# Altium schematic sheet NG2094_Connector_B.SchDoc: =project_title
size Tabloid; CompanyName: Luxonis Holding; Organization: Luxonis Holding; Address1: 1925 Harmony Park Drive; Address2: Westminster, CO; Address3: 80234; Address4: United States; SheetNumber: 4; SheetTotal: 11
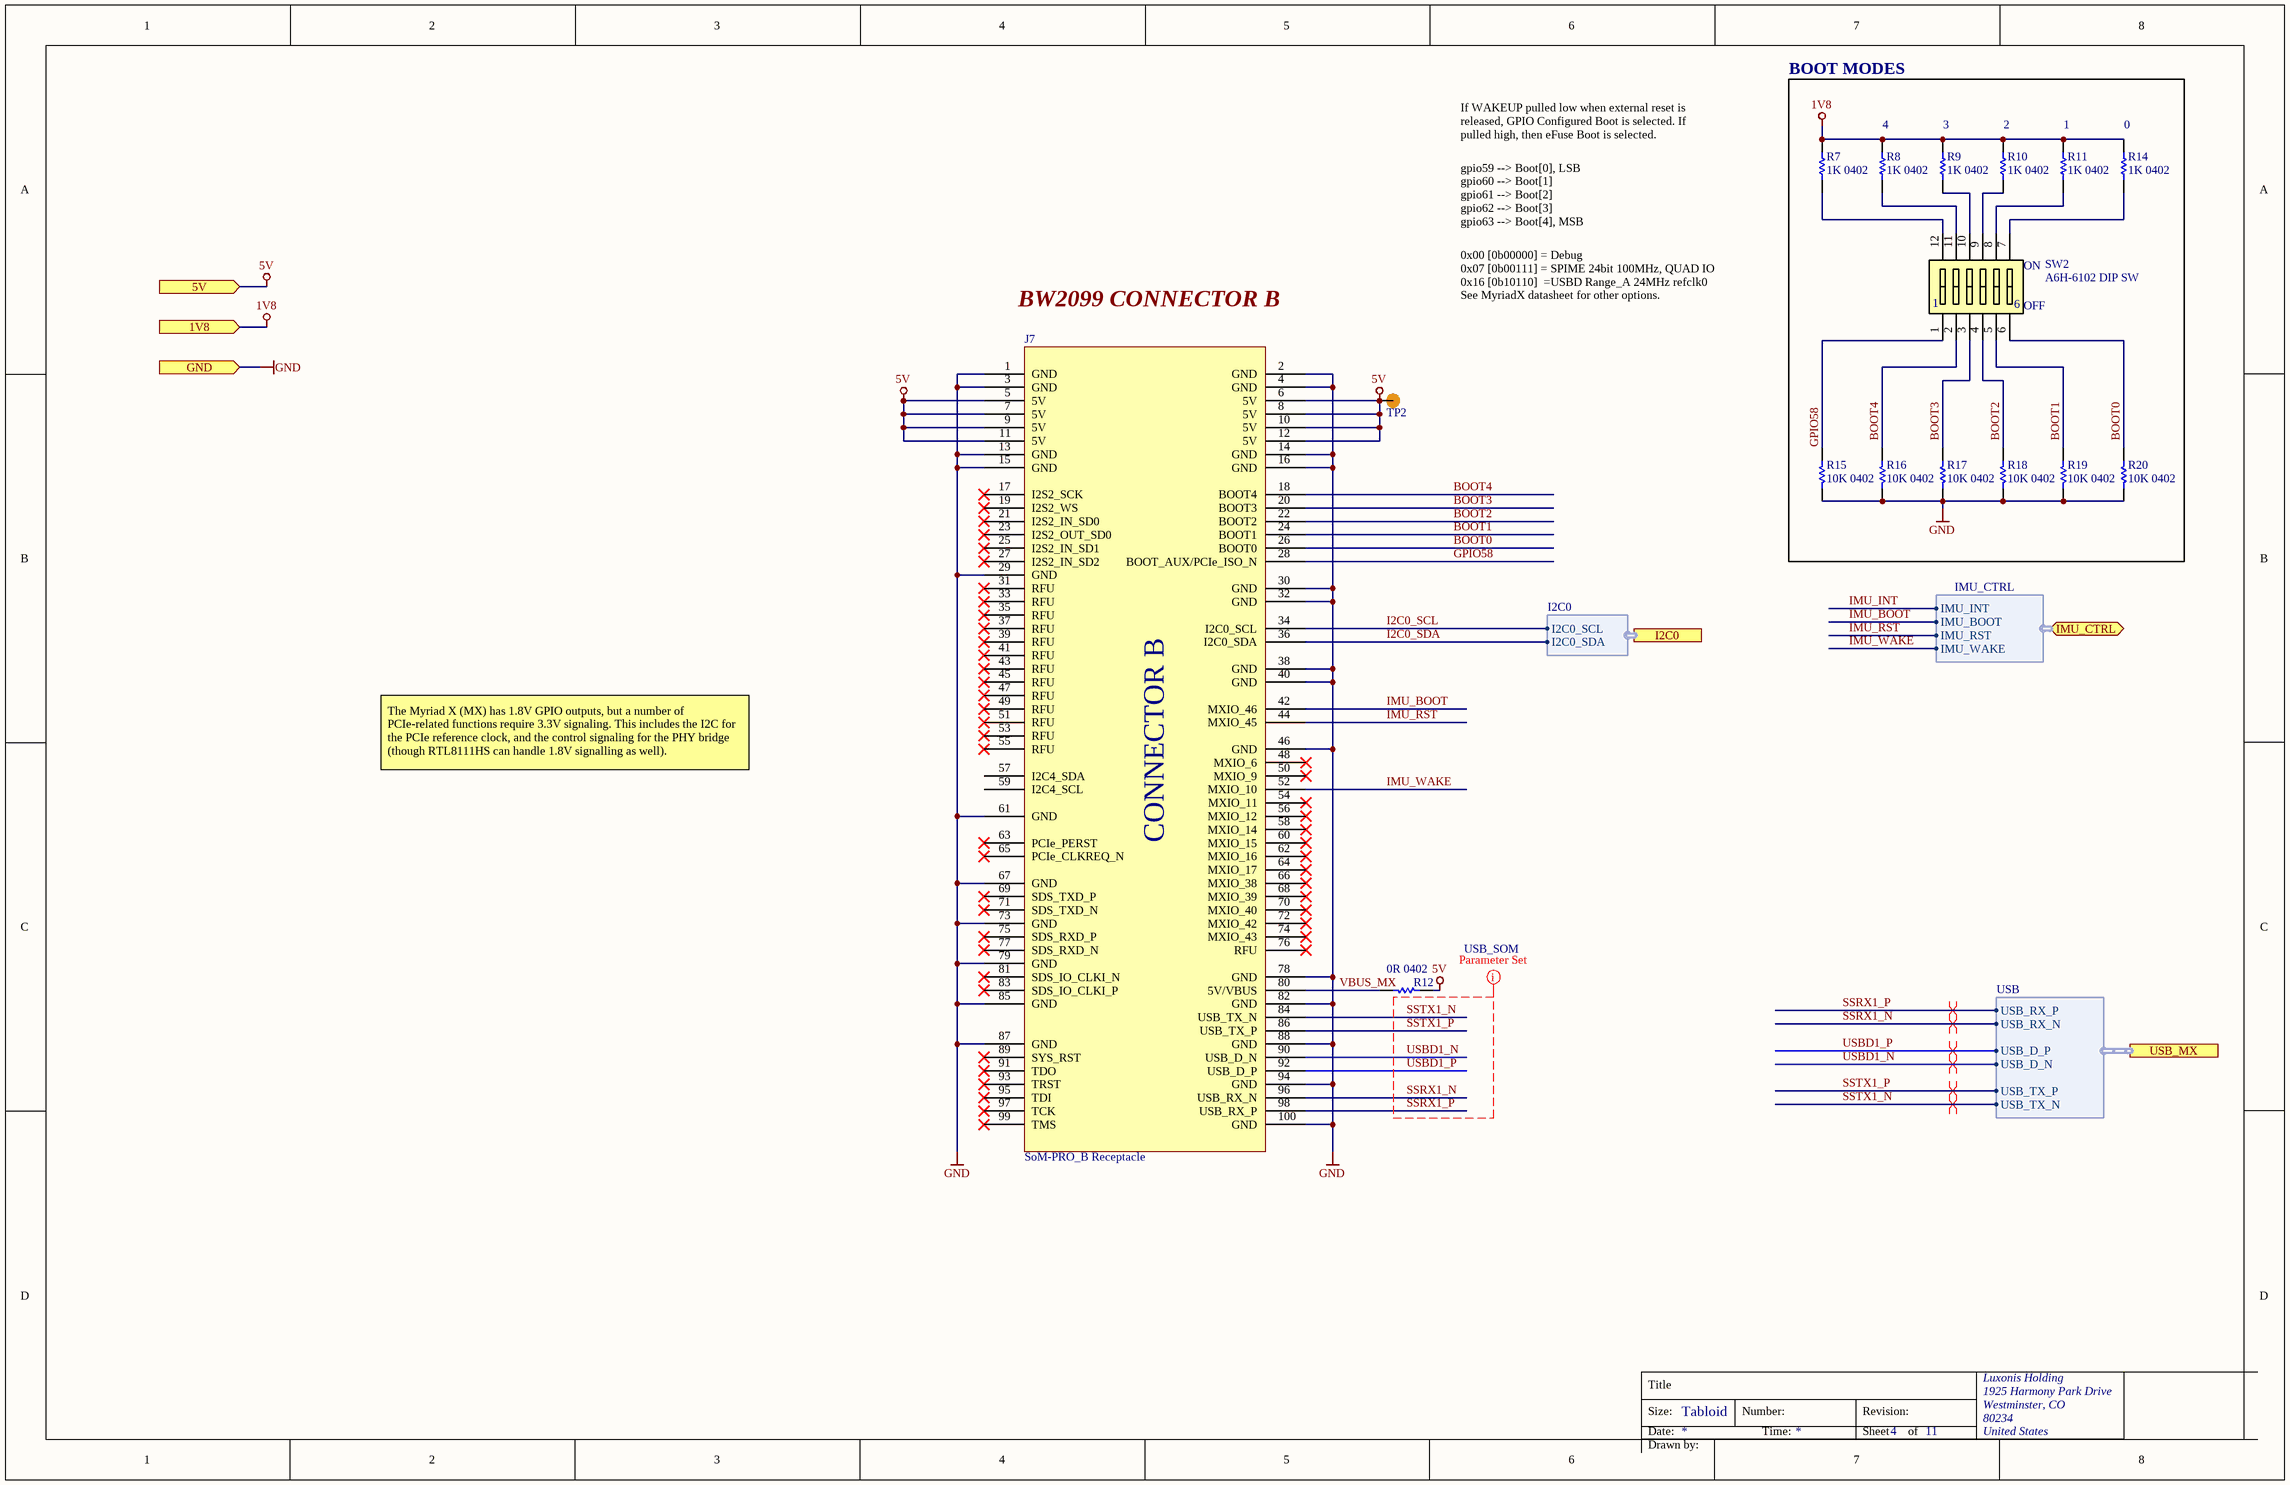
[diagram p0: NG2094_Connector_B.SchDoc]

## Parts
J7  SoM-PRO_B Receptacle  [CON_B_BW2099_SoM_DF40HC-3.0-100DS-0.4V_minpad]
R7  1K 0402  [RESC0402(1005)_L]
R8  1K 0402  [RESC0402(1005)_L]
R9  1K 0402  [RESC0402(1005)_L]
R10  1K 0402  [RESC0402(1005)_L]
R11  1K 0402  [RESC0402(1005)_L]
R12  0R 0402  [RESC0402(1005)_L]
R14  1K 0402  [RESC0402(1005)_L]
R15  10K 0402  [RESC0402(1005)_L]
R16  10K 0402  [RESC0402(1005)_L]
R17  10K 0402  [RESC0402(1005)_L]
R18  10K 0402  [RESC0402(1005)_L]
R19  10K 0402  [RESC0402(1005)_L]
R20  10K 0402  [RESC0402(1005)_L]
SW2  A6H-6102 DIP SW  [A6H-610x]
TP2  TP100_200_NS  [TP100_200_NS]  (value not drawn)  (no BOM)

## Blocks framed on the sheet
BOOT MODES: R7-R11 R14-R20 SW2

## Ports
1V8 (in), 5V (in), GND (in), I2C0 (harness I2C0), IMU_CTRL (bidir, harness IMU_CTRL), USB_MX (harness USB)

## Harnesses
USB: USB_D_P, USB_D_N, USB_TX_N, USB_TX_P, USB_RX_N, USB_RX_P
IMU_CTRL: IMU_BOOT, IMU_RST, IMU_INT, IMU_WAKE
I2C0: I2C0_SDA, I2C0_SCL

## Nets
1V8: R7.2 R8.2 R9.2 R10.2 R11.2 R14.2 ; port 1V8
5V: J7.5(5V) J7.6(5V) J7.7(5V) J7.8(5V) J7.9(5V) J7.10(5V) J7.11(5V) J7.12(5V) R12.2 TP2.1 ; port 5V
GND: J7.1(GND) J7.2(GND) J7.3(GND) J7.4(GND) J7.13(GND) J7.14(GND) J7.15(GND) J7.16(GND) J7.29(GND) J7.30(GND) J7.32(GND) J7.38(GND) J7.40(GND) J7.46(GND) J7.61(GND) J7.67(GND) J7.73(GND) J7.78(GND) J7.79(GND) J7.82(GND) J7.85(GND) J7.87(GND) J7.88(GND) J7.94(GND) J7.100(GND) R15.2 R16.2 R17.2 R18.2 R19.2 R20.2 ; port GND
BOOT0: J7.26(BOOT0) R20.1 SW2.6
BOOT1: J7.24(BOOT1) R19.1 SW2.5
BOOT2: J7.22(BOOT2) R18.1 SW2.4
BOOT3: J7.20(BOOT3) R17.1 SW2.3
BOOT4: J7.18(BOOT4) R16.1 SW2.2
GPIO58: J7.28(BOOT_AUX/PCIe_ISO_N) R15.1 SW2.1
I2C0_SCL: J7.34(I2C0_SCL) ; port I2C0.I2C0_SCL
I2C0_SDA: J7.36(I2C0_SDA) ; port I2C0.I2C0_SDA
IMU_BOOT: J7.42(MXIO_46) ; port IMU_CTRL.IMU_BOOT
IMU_INT: port IMU_CTRL.IMU_INT
IMU_RST: J7.44(MXIO_45) ; port IMU_CTRL.IMU_RST
IMU_WAKE: J7.52(MXIO_10) ; port IMU_CTRL.IMU_WAKE
SSRX1_N: J7.96(USB_RX_N) ; port USB_MX.USB_RX_N
SSRX1_P: J7.98(USB_RX_P) ; port USB_MX.USB_RX_P
SSTX1_N: J7.84(USB_TX_N) ; port USB_MX.USB_TX_N
SSTX1_P: J7.86(USB_TX_P) ; port USB_MX.USB_TX_P
USBD1_N: J7.90(USB_D_N) ; port USB_MX.USB_D_N
USBD1_P: J7.92(USB_D_P) ; port USB_MX.USB_D_P
VBUS_MX: J7.80(5V/VBUS) R12.1
NetR7_1: R7.1 SW2.12
NetR8_1: R8.1 SW2.11
NetR9_1: R9.1 SW2.10
NetR10_1: R10.1 SW2.9
NetR11_1: R11.1 SW2.8
NetR14_1: R14.1 SW2.7

Not connected (* = marked no-connect by the designer): J7 17(I2S2_SCK)* 19(I2S2_WS)* 21(I2S2_IN_SD0)* 23(I2S2_OUT_SD0)* 25(I2S2_IN_SD1)* 27(I2S2_IN_SD2)* 31(RFU)* 33(RFU)* 35(RFU)* 37(RFU)* 39(RFU)* 41(RFU)* 43(RFU)* 45(RFU)* 47(RFU)* 48(MXIO_6)* 49(RFU)* 50(MXIO_9)* 51(RFU)* 53(RFU)* 54(MXIO_11)* 55(RFU)* 56(MXIO_12)* 57(I2C4_SDA) 58(MXIO_14)* 59(I2C4_SCL) 60(MXIO_15)* 62(MXIO_16)* 63(PCIe_PERST)* 64(MXIO_17)* 65(PCIe_CLKREQ_N)* 66(MXIO_38)* 68(MXIO_39)* 69(SDS_TXD_P)* 70(MXIO_40)* 71(SDS_TXD_N)* 72(MXIO_42)* 74(MXIO_43)* 75(SDS_RXD_P)* 76(RFU)* 77(SDS_RXD_N)* 81(SDS_IO_CLKI_N)* 83(SDS_IO_CLKI_P)* 89(SYS_RST)* 91(TDO)* 93(TRST)* 95(TDI)* 97(TCK)* 99(TMS)*

## Layout directives
differential pair; differential pair class 90ohm: SSRX1_N, SSRX1_P, SSTX1_N, SSTX1_P, USBD1_N, USBD1_P
net class USB_SOM: SSRX1_N, SSRX1_P, SSTX1_N, SSTX1_P, USBD1_N, USBD1_P

## Notes on the sheet
- If WAKEUP pulled low when external reset is released, GPIO Configured Boot is selected. If pulled high, then eFuse Boot is selected.
- (near R8) 4
- (near R9) 3
- (near R10) 2
- (near R11) 1
- (near R14) 0
- gpio59 --> Boot[0], LSB
  gpio60 --> Boot[1]
  gpio61 --> Boot[2]
  gpio62 --> Boot[3]
  gpio63 --> Boot[4], MSB
- 0x00 [0b00000] = Debug
  0x07 [0b00111] = SPIME 24bit 100MHz, QUAD IO
  0x16 [0b10110]  =USBD Range_A 24MHz refclk0
  See MyriadX datasheet for other options.
- BW2099 CONNECTOR B
- The Myriad X (MX) has 1.8V GPIO outputs, but a number of PCIe-related functions require 3.3V signaling. This includes the I2C for the PCIe reference clock, and the control signaling for the PHY bridge (though RTL8111HS can handle 1.8V signalling as well).
- Title
- Size:
- Date:
- Tabloid
- Number:
- Time:
- Revision:
- Sheet
- of
- Drawn by:
- (in symbol A6H-6102) ON; OFF
- (in symbol DF40HC(3.0)-100DS-0.4V_SoM-PRO_B) CONNECTOR B

## Library data of the parts
J7 = DF40HC(3.0)-100DS-0.4V_SoM-PRO_B: CONN RCPT 100POS 0.4MM SMD GOLD; Manufacturer 1: Hirose; Manufacturer Part Number 1: DF40HC(3.0)-100DS-0.4V(58); Number of Positions: 100; Pitch: 0.016inch; System: Connector; RoHS: Yes; Mount: Surface Mount; Contact Plating: Gold; Packaging: Tape and Reel; Number of Rows: 2; Package Quantity: 1000; Connector Type: Receptacle; Lead Free: Lead Free; ComponentLink1URL: https://datasheet.ciiva.com/46636/ed-df40-20140305-46636517.pdf?src-supplier=Digi-Key; ComponentLink1Description: https://datasheet.ciiva.com/46636/ed-df40-20140305-46636517.pdf?src-supplier=Digi-Key; ComponentLink2URL: https://datasheet.ciiva.com/18562/ed-df40-20140305-18562189.pdf?src-supplier=Digi-Key; ComponentLink2Description: https://datasheet.ciiva.com/18562/ed-df40-20140305-18562189.pdf?src-supplier=Digi-Key; ComponentLink3URL: https://datasheet.ciiva.com/13559/ed-df40-20140305-13559540.pdf?src-supplier=Mouser; ComponentLink3Description: https://datasheet.ciiva.com/13559/ed-df40-20140305-13559540.pdf?src-supplier=Mouser; ComponentLink4URL: https://datasheet.ciiva.com/18562/ed-df40-20140305-18562462.pdf?src-supplier=Digi-Key; ComponentLink4Description: https://datasheet.ciiva.com/18562/ed-df40-20140305-18562462.pdf?src-supplier=Digi-Key; Supplier 1: Mouser; Stock 1: 2172; Pricing 1: 1=2.54000, 10=2.26000, 25=2.07000, 50=2.07000, 100=1.98000, 250=1.79000, 500=1.65000, 1000=1.41000, 3000=1.32000, 6000=1.23000, 10000=1.23000 (USD); Supplier 2: Mouser; Stock 2: 2078; Pricing 2: 1=2.50000, 10=2.40000, 25=2.10000, 50=2.10000, 100=2.00000, 250=1.76000, 500=1.71000, 1000=1.45000, 2000=1.36000, 5000=1.31000, 10000=1.31000 (USD); Supplier Part Number 1: 798-DF40HC30100DS451; Supplier Part Number 2: 798-DF40HC30100DS458
R7-R11 R14 = RC0402FR-071KL: RES SMD 1K OHM 1% 1/16W 0402 1 kOhms ±1% 0.063W, 1/16W Chip Resistor 0402 (1005 Metric) Moisture Resistant Thick Film; Manufacturer 1: Yageo; Temperature Coefficient: 100ppm/°C; Power Rating: 62.5mW; Voltage Rating (DC): 50V; Resistance: 1kR; RoHS: Yes; Number of Pins: 2; Case Code (Imperial): 0402; Case Code (Metric): 1005; Min Operating Temperature: -55°C; Max Operating Temperature: 155°C; Packaging: Tape and Reel; Composition: Thick Film; Voltage Rating: 50V; Military Standard: Not; Termination: SMD/SMT; Length: 1mm; Height: 0.32mm; Width: 0.5mm; Depth: 0.5mm; Lead Free: Lead Free; REACH SVHC: Unknown; ComponentLink1URL: https://datasheet.ciiva.com/11819/0900766b80c66297-11819477.pdf?src-supplier=RSComponents; ComponentLink1Description: https://datasheet.ciiva.com/11819/0900766b80c66297-11819477.pdf?src-supplier=RSComponents; ComponentLink2URL: https://datasheet.ciiva.com/12666/pyu-rc0402-51-rohs-l-6-r-12666741.pdf?src-supplier=Mouser; ComponentLink2Description: https://datasheet.ciiva.com/12666/pyu-rc0402-51-rohs-l-6-r-12666741.pdf?src-supplier=Mouser; ComponentLink3URL: https://datasheet.ciiva.com/17063/pyu-rc0402-51-rohs-l-6-r-17063193.pdf?src-supplier=Future+Electronics; ComponentLink3Description: https://datasheet.ciiva.com/17063/pyu-rc0402-51-rohs-l-6-r-17063193.pdf?src-supplier=Future+Electronics; ComponentLink4URL: https://datasheet.ciiva.com/22747/1018594-22747513.pdf?src-supplier=Element14; ComponentLink4Description: https://datasheet.ciiva.com/22747/1018594-22747513.pdf?src-supplier=Element14; ComponentLink5URL: https://datasheet.ciiva.com/7849/1018594-7849869.pdf?src-supplier=Element14; ComponentLink5Description: https://datasheet.ciiva.com/7849/1018594-7849869.pdf?src-supplier=Element14; ComponentLink6URL: https://datasheet.ciiva.com/7983/1018594-7983502.pdf?src-supplier=Element14; ComponentLink6Description: https://datasheet.ciiva.com/7983/1018594-7983502.pdf?src-supplier=Element14; ComponentLink7URL: https://datasheet.ciiva.com/7849/1018594-7849871.pdf?src-supplier=Element14; ComponentLink7Description: https://datasheet.ciiva.com/7849/1018594-7849871.pdf?src-supplier=Element14; Supplier 1: Digi-Key; Manufacturer Part Number 1: RC0402FR-071KL; Stock 1: 60695854; Pricing 1: 1=0.10000, 10=0.01600, 100=0.00670, 1000=0.00301, 2500=0.00261, 5000=0.00215 (USD); Case/Package: 0402; Tolerance: 1%; Supplier Part Number 1: 311-1.00KLRCT-ND
R12 = CRCW04020000Z0ED: RES SMD 0 OHM JUMPER 1/16W 0402; Manufacturer 1: Vishay; Resistance: 0mR; Power Rating: 63mW; Voltage Rating: 50V; Temperature Coefficient: 100ppm/°C; Tolerance: 5%; Manufacturer Part Number 1: CRCW04020000Z0ED; Supplier 1: Digi-Key; Stock 1: 855968; Pricing 1: 1=0.10000, 10=0.03400, 25=0.02440, 50=0.01860, 100=0.01380, 250=0.01048, 500=0.00840, 1000=0.00618, 5000=0.00443 (USD); RoHS: Yes; Mount: Surface Mount; Case/Package: 0402; Weight: 2.3E-05oz; Case Code (Imperial): 0402; Case Code (Metric): 1005; Contact Plating: Tin; Min Operating Temperature: -55°C; Max Operating Temperature: 155°C; Packaging: Tape and Reel; Composition: Thick Film; Voltage Rating (DC): 50V; Package Quantity: 1; Termination: SMD/SMT; Number of Terminations: 2; Military Standard: Not; Max Power Dissipation: 63mW; Features: Automotive AEC-Q200; Length: 1mm; Height: 0.35mm; Width: 0.5mm; Depth: 0.5mm; Radiation Hardening: No; REACH SVHC: Unknown; Lead Free: Lead Free; ComponentLink1URL: https://datasheet.ciiva.com/3255/dcrcwe3-3255944.pdf?src-supplier=Avnet; ComponentLink1Description: https://datasheet.ciiva.com/3255/dcrcwe3-3255944.pdf?src-supplier=Avnet; ComponentLink2URL: https://datasheet.ciiva.com/3255/dcrcwe3-3255945.pdf?src-supplier=Avnet; ComponentLink2Description: https://datasheet.ciiva.com/3255/dcrcwe3-3255945.pdf?src-supplier=Avnet; ComponentLink3URL: https://datasheet.ciiva.com/16881/dcrcwe3-16881413.pdf?src-supplier=Avnet+Europe; ComponentLink3Description: https://datasheet.ciiva.com/16881/dcrcwe3-16881413.pdf?src-supplier=Avnet+Europe; ComponentLink4URL: https://datasheet.ciiva.com/2461/dcrcwe3-2461962.pdf?src-supplier=Digi-Key; ComponentLink4Description: https://datasheet.ciiva.com/2461/dcrcwe3-2461962.pdf?src-supplier=Digi-Key; ComponentLink5URL: https://datasheet.ciiva.com/7841/1720486-7841802.pdf?src-supplier=Element14; ComponentLink5Description: https://datasheet.ciiva.com/7841/1720486-7841802.pdf?src-supplier=Element14; ComponentLink6URL: https://datasheet.ciiva.com/2461/dcrcwe3-2461963.pdf?src-supplier=Digi-Key; ComponentLink6Description: https://datasheet.ciiva.com/2461/dcrcwe3-2461963.pdf?src-supplier=Digi-Key; ComponentLink7URL: https://datasheet.ciiva.com/2461/dcrcwe3-2461964.pdf?src-supplier=Digi-Key; ComponentLink7Description: https://datasheet.ciiva.com/2461/dcrcwe3-2461964.pdf?src-supplier=Digi-Key; ComponentLink8URL: https://datasheet.ciiva.com/7841/1697337-7841468.pdf?src-supplier=Element14; ComponentLink8Description: https://datasheet.ciiva.com/7841/1697337-7841468.pdf?src-supplier=Element14; ComponentLink9URL: https://datasheet.ciiva.com/16761/70200976-16761309.pdf?src-supplier=Allied+Electronics; ComponentLink9Description: https://datasheet.ciiva.com/16761/70200976-16761309.pdf?src-supplier=Allied+Electronics; ComponentLink10URL: https://datasheet.ciiva.com/26311/fld-crcw-e3-data-en-26311550.pdf?src-supplier=Distrelec; ComponentLink10Description: https://datasheet.ciiva.com/26311/fld-crcw-e3-data-en-26311550.pdf?src-supplier=Distrelec; Supplier Part Number 1: 541-0.0JCT-ND
R15-R20 = RC0402FR-1310KL: RES SMD 10K OHM 1% 0402 1/16W Chip Resistor, 0402 [1005 Metric], 10 kohm, RC Series, 50 V, Thick Film, 62.5 mW; Manufacturer 1: Yageo; Resistance: 10kR; Temperature Coefficient: 100ppm/°C; Power Rating: 62.5mW; Voltage Rating: 50V; ComponentLink1URL: https://datasheet.ciiva.com/16940/pyu-rc0402-51-rohs-l-6-16940293.pdf?src-supplier=Avnet+Europe; ComponentLink1Description: https://datasheet.ciiva.com/16940/pyu-rc0402-51-rohs-l-6-16940293.pdf?src-supplier=Avnet+Europe; ComponentLink2URL: https://datasheet.ciiva.com/28386/pyu-rc0402-51-rohs-l-6-28386855.pdf?src-supplier=Avnet+Europe; ComponentLink2Description: https://datasheet.ciiva.com/28386/pyu-rc0402-51-rohs-l-6-28386855.pdf?src-supplier=Avnet+Europe; ComponentLink3URL: https://datasheet.ciiva.com/16740/pyu-rc0402-51-rohs-l-6-r-16740602.pdf?src-supplier=Future+Electronics; ComponentLink3Description: https://datasheet.ciiva.com/16740/pyu-rc0402-51-rohs-l-6-r-16740602.pdf?src-supplier=Future+Electronics; ComponentLink4URL: https://datasheet.ciiva.com/8891/pyu-rc0402-51-rohs-l-6-8891339.pdf?src-supplier=Avnet; ComponentLink4Description: https://datasheet.ciiva.com/8891/pyu-rc0402-51-rohs-l-6-8891339.pdf?src-supplier=Avnet; ComponentLink5URL: https://datasheet.ciiva.com/5557/pyu-rc0402-51-rohs-l-6-r-5557997.pdf?src-supplier=Mouser; ComponentLink5Description: https://datasheet.ciiva.com/5557/pyu-rc0402-51-rohs-l-6-r-5557997.pdf?src-supplier=Mouser; ComponentLink6URL: https://datasheet.ciiva.com/7983/1018594-7983533.pdf?src-supplier=Element14; ComponentLink6Description: https://datasheet.ciiva.com/7983/1018594-7983533.pdf?src-supplier=Element14; Supplier 1: Newark; Manufacturer Part Number 1: RC0402FR-1310KL; Stock 1: 62239; Pricing 1: 1=0.10000, 25=0.01200, 100=0.00400, 250=0.00400, 500=0.00300, 1000=0.00300 (USD); RoHS: Yes; Case/Package: 0402; Number of Pins: 2; Contact Plating: Tin,Matte,Lead; Case Code (Imperial): 0402; Case Code (Metric): 1005; Min Operating Temperature: -55°C; Max Operating Temperature: 155°C; Tolerance: 1%; Composition: Thick Film; Packaging: Tape and Reel; Termination: SMD/SMT; Military Standard: Not; Voltage Rating (DC): 50V; Working Voltage: 50V; Number of Terminations: 2; Length: 1mm; Depth: 0.5mm; Radiation Hardening: No; REACH SVHC: No SVHC; Lead Free: Lead Free; Supplier Part Number 1: 67R9960
SW2 = A6H-6102: SWITCH SLIDE DIP SPST 25MA 24V (SEALED); Manufacturer 1: Omron; Mechanical Life: 1000Cycles; Contact Resistance: 200mR; Number of Positions: 6; Actuator Type: Slide (Standard); Number of Poles: 4; Pitch: 0.05inch; Actuator Length: 0mm; Washable: Yes; Supplier 1: Digi-Key; Manufacturer Part Number 1: A6H-6102; Stock 1: 3953; Pricing 1: 1=2.66000, 10=2.57900, 25=2.44640, 50=2.28700, 100=2.23380, 250=1.91468, 500=1.86148, 1000=1.59555, 5000=1.46259 (USD); RoHS: Yes; Mount: Surface Mount; Case/Package: DIP; Weight: 0.12g; Min Operating Temperature: -20°C; Max Operating Temperature: 70°C; Voltage Rating (DC): 24V; Throw Configuration: SPST; Packaging: Rail/Tube; Max Current Rating: 25mA; Termination: Gull Wing; Orientation: Straight; Max Voltage Rating (DC): 24V; Current Rating: 25mA; Package Quantity: 54; Electrical Life: 1000Cycles; Number of Circuits: 6; Length: 0.348inch; Height: 1.55mm; Terminal Pitch: 1.27mm; Depth: 6.7mm; Width: 4.5mm; Radiation Hardening: No; REACH SVHC: Unknown; ComponentLink1URL: https://datasheet.ciiva.com/26883/getdatasheetpartid-744653-26883354.pdf?src-supplier=Verical; ComponentLink1Description: https://datasheet.ciiva.com/26883/getdatasheetpartid-744653-26883354.pdf?src-supplier=Verical; ComponentLink2URL: https://datasheet.ciiva.com/2864/a6h-1110-2864768.pdf?src-supplier=Digi-Key; ComponentLink2Description: https://datasheet.ciiva.com/2864/a6h-1110-2864768.pdf?src-supplier=Digi-Key; ComponentLink3URL: https://datasheet.ciiva.com/1529/611565-1529044.pdf?src-supplier=Element14; ComponentLink3Description: https://datasheet.ciiva.com/1529/611565-1529044.pdf?src-supplier=Element14; ComponentLink4URL: https://datasheet.ciiva.com/16198/a6h-1110-16198863.pdf?src-supplier=Onlinecomponents.com; ComponentLink4Description: https://datasheet.ciiva.com/16198/a6h-1110-16198863.pdf?src-supplier=Onlinecomponents.com; Supplier 2: Mouser; Supplier 3: Farnell; Supplier Part Number 2: 653-A6H-6102; Supplier Part Number 1: SW1117-ND; Supplier Part Number 3: 1829491
TP2 = TEST_POINT